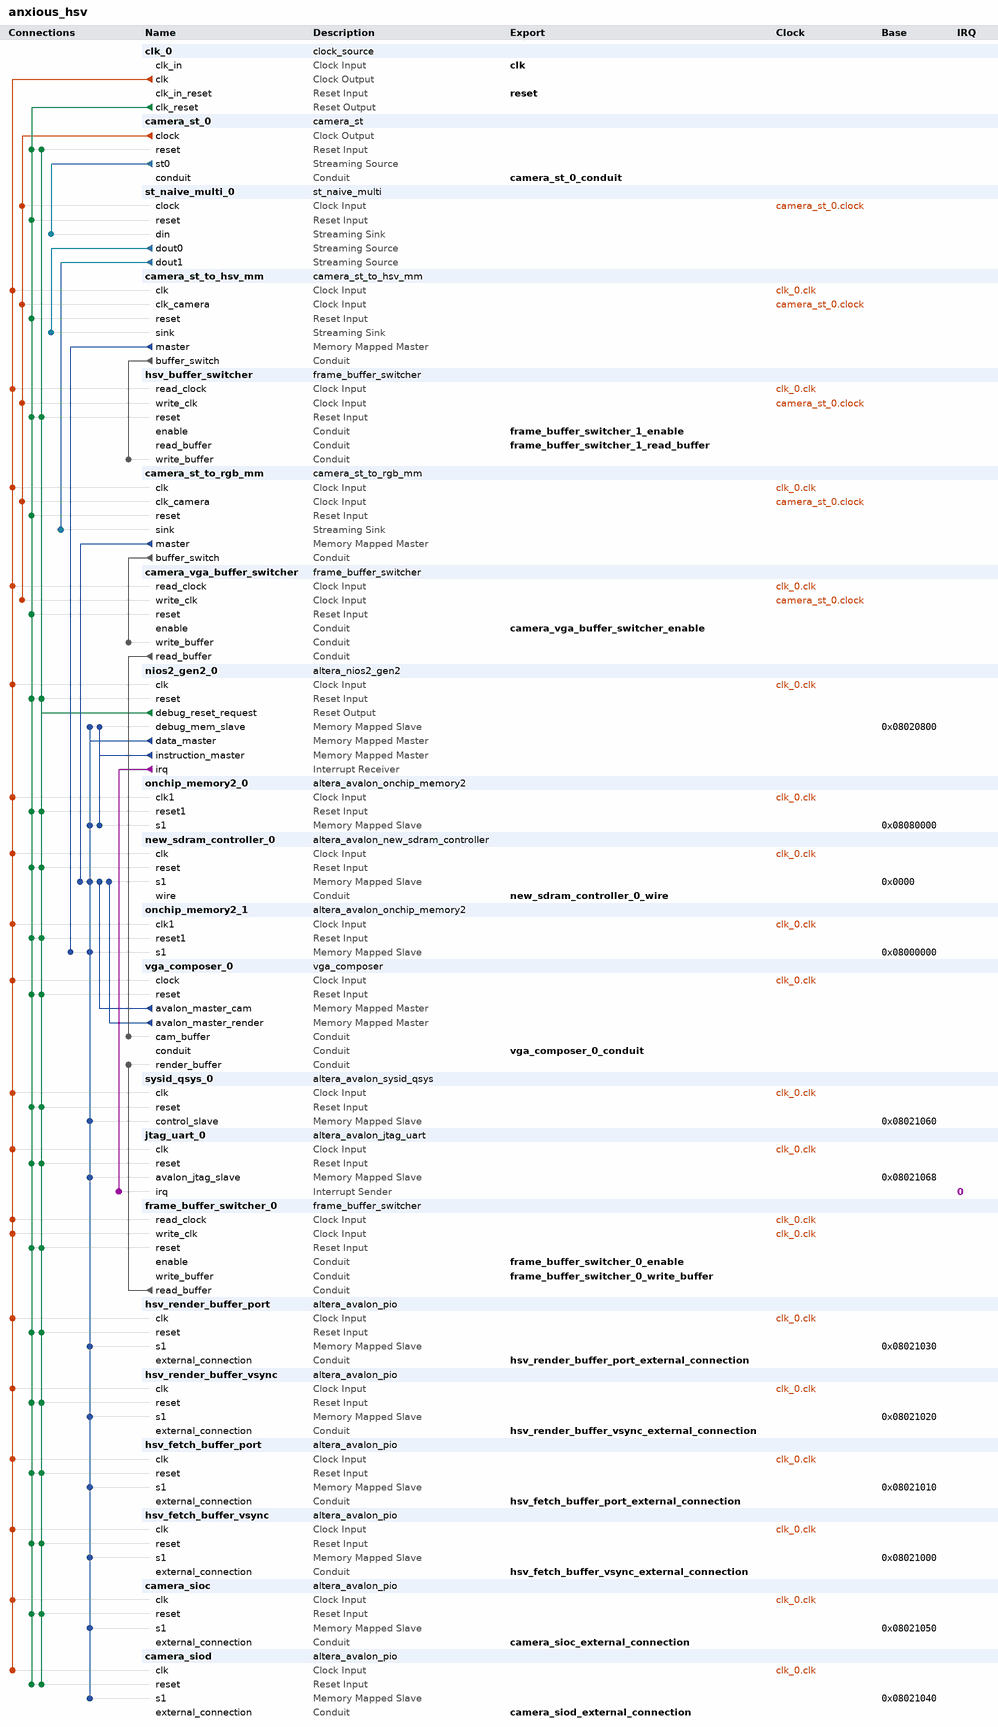
[diagram p0: system contents]
# Platform Designer (Qsys) system anxious_hsv, Cyclone IV GX EP4CGX150DF31C7
# Parameters at their usual value, and those the tool derives, are not listed.
package require -exact qsys 15.0
create_system anxious_hsv
set_project_property DEVICE_FAMILY {Cyclone IV GX}
set_project_property DEVICE EP4CGX150DF31C7

add_instance clk_0 clock_source 15.0
set_instance_parameter_value clk_0 clockFrequency 50000000

add_instance camera_st_0 camera_st 1.0
set_instance_parameter_value camera_st_0 DATA_WIDTH 24

add_instance st_naive_multi_0 st_naive_multi 1.0
set_instance_parameter_value st_naive_multi_0 DIN_DATA_WIDTH 24
set_instance_parameter_value st_naive_multi_0 DOUT0_DATA_WIDTH 24
set_instance_parameter_value st_naive_multi_0 DOUT1_DATA_WIDTH 32

add_instance camera_st_to_hsv_mm camera_st_to_hsv_mm 1.0

add_instance hsv_buffer_switcher frame_buffer_switcher 2.0

add_instance camera_st_to_rgb_mm camera_st_to_rgb_mm 1.0

add_instance camera_vga_buffer_switcher frame_buffer_switcher 2.0

add_instance nios2_gen2_0 altera_nios2_gen2 15.0
set_instance_parameter_value nios2_gen2_0 dcache_size 2048
set_instance_parameter_value nios2_gen2_0 exceptionSlave onchip_memory2_0.s1
set_instance_parameter_value nios2_gen2_0 icache_size 4096
set_instance_parameter_value nios2_gen2_0 impl Fast
set_instance_parameter_value nios2_gen2_0 resetSlave onchip_memory2_0.s1

add_instance onchip_memory2_0 altera_avalon_onchip_memory2 15.0
set_instance_parameter_value onchip_memory2_0 dataWidth 32
set_instance_parameter_value onchip_memory2_0 dualPort false
set_instance_parameter_value onchip_memory2_0 initMemContent true
set_instance_parameter_value onchip_memory2_0 initializationFileName onchip_mem.hex
set_instance_parameter_value onchip_memory2_0 memorySize 204800

add_instance new_sdram_controller_0 altera_avalon_new_sdram_controller 15.0
set_instance_parameter_value new_sdram_controller_0 TAC 5.5
set_instance_parameter_value new_sdram_controller_0 TRCD 20.0
set_instance_parameter_value new_sdram_controller_0 TRP 20.0
set_instance_parameter_value new_sdram_controller_0 casLatency 3
set_instance_parameter_value new_sdram_controller_0 columnWidth 10
set_instance_parameter_value new_sdram_controller_0 dataWidth 32
set_instance_parameter_value new_sdram_controller_0 generateSimulationModel false
set_instance_parameter_value new_sdram_controller_0 initRefreshCommands 8
set_instance_parameter_value new_sdram_controller_0 model single_Micron_MT48LC4M32B2_7_chip
set_instance_parameter_value new_sdram_controller_0 numberOfBanks 4
set_instance_parameter_value new_sdram_controller_0 numberOfChipSelects 1
set_instance_parameter_value new_sdram_controller_0 powerUpDelay 100.0
set_instance_parameter_value new_sdram_controller_0 refreshPeriod 7.8125
set_instance_parameter_value new_sdram_controller_0 rowWidth 13

add_instance onchip_memory2_1 altera_avalon_onchip_memory2 15.0
set_instance_parameter_value onchip_memory2_1 dataWidth 32
set_instance_parameter_value onchip_memory2_1 dualPort false
set_instance_parameter_value onchip_memory2_1 initMemContent true
set_instance_parameter_value onchip_memory2_1 initializationFileName onchip_mem.hex
set_instance_parameter_value onchip_memory2_1 memorySize 131072

add_instance vga_composer_0 vga_composer 1.1
set_instance_parameter_value vga_composer_0 ADDR_WIDTH 27
set_instance_parameter_value vga_composer_0 CAM_BANK 0
set_instance_parameter_value vga_composer_0 DATA_WIDTH 32
set_instance_parameter_value vga_composer_0 FIFO_LENGTH_LOG_2 6
set_instance_parameter_value vga_composer_0 RENDER_BANK 1

add_instance sysid_qsys_0 altera_avalon_sysid_qsys 15.0
set_instance_parameter_value sysid_qsys_0 id 2004318071

add_instance jtag_uart_0 altera_avalon_jtag_uart 15.0
set_instance_parameter_value jtag_uart_0 simInteractiveOptions NO_INTERACTIVE_WINDOWS

add_instance frame_buffer_switcher_0 frame_buffer_switcher 2.0

add_instance hsv_render_buffer_port altera_avalon_pio 15.0
set_instance_parameter_value hsv_render_buffer_port direction Input
set_instance_parameter_value hsv_render_buffer_port width 2

add_instance hsv_render_buffer_vsync altera_avalon_pio 15.0
set_instance_parameter_value hsv_render_buffer_vsync direction Output
set_instance_parameter_value hsv_render_buffer_vsync width 1

add_instance hsv_fetch_buffer_port altera_avalon_pio 15.0
set_instance_parameter_value hsv_fetch_buffer_port direction Input
set_instance_parameter_value hsv_fetch_buffer_port width 2

add_instance hsv_fetch_buffer_vsync altera_avalon_pio 15.0
set_instance_parameter_value hsv_fetch_buffer_vsync direction Output
set_instance_parameter_value hsv_fetch_buffer_vsync width 1

add_instance camera_sioc altera_avalon_pio 15.0
set_instance_parameter_value camera_sioc direction Output
set_instance_parameter_value camera_sioc width 1

add_instance camera_siod altera_avalon_pio 15.0
set_instance_parameter_value camera_siod direction Bidir
set_instance_parameter_value camera_siod width 1

# connections
add_connection camera_st_0.clock camera_st_to_hsv_mm.clk_camera clock
add_connection camera_st_0.clock camera_st_to_rgb_mm.clk_camera clock
add_connection camera_st_0.clock camera_vga_buffer_switcher.write_clk clock
add_connection camera_st_0.clock hsv_buffer_switcher.write_clk clock
add_connection camera_st_0.clock st_naive_multi_0.clock clock
add_connection clk_0.clk camera_sioc.clk clock
add_connection clk_0.clk camera_siod.clk clock
add_connection clk_0.clk camera_st_to_hsv_mm.clk clock
add_connection clk_0.clk camera_st_to_rgb_mm.clk clock
add_connection clk_0.clk camera_vga_buffer_switcher.read_clock clock
add_connection clk_0.clk frame_buffer_switcher_0.read_clock clock
add_connection clk_0.clk frame_buffer_switcher_0.write_clk clock
add_connection clk_0.clk hsv_buffer_switcher.read_clock clock
add_connection clk_0.clk hsv_fetch_buffer_port.clk clock
add_connection clk_0.clk hsv_fetch_buffer_vsync.clk clock
add_connection clk_0.clk hsv_render_buffer_port.clk clock
add_connection clk_0.clk hsv_render_buffer_vsync.clk clock
add_connection clk_0.clk jtag_uart_0.clk clock
add_connection clk_0.clk new_sdram_controller_0.clk clock
add_connection clk_0.clk nios2_gen2_0.clk clock
add_connection clk_0.clk onchip_memory2_0.clk1 clock
add_connection clk_0.clk onchip_memory2_1.clk1 clock
add_connection clk_0.clk sysid_qsys_0.clk clock
add_connection clk_0.clk vga_composer_0.clock clock
add_connection clk_0.clk_reset camera_sioc.reset reset
add_connection clk_0.clk_reset camera_siod.reset reset
add_connection clk_0.clk_reset camera_st_0.reset reset
add_connection clk_0.clk_reset camera_st_to_hsv_mm.reset reset
add_connection clk_0.clk_reset camera_st_to_rgb_mm.reset reset
add_connection clk_0.clk_reset camera_vga_buffer_switcher.reset reset
add_connection clk_0.clk_reset frame_buffer_switcher_0.reset reset
add_connection clk_0.clk_reset hsv_buffer_switcher.reset reset
add_connection clk_0.clk_reset hsv_fetch_buffer_port.reset reset
add_connection clk_0.clk_reset hsv_fetch_buffer_vsync.reset reset
add_connection clk_0.clk_reset hsv_render_buffer_port.reset reset
add_connection clk_0.clk_reset hsv_render_buffer_vsync.reset reset
add_connection clk_0.clk_reset jtag_uart_0.reset reset
add_connection clk_0.clk_reset new_sdram_controller_0.reset reset
add_connection clk_0.clk_reset nios2_gen2_0.reset reset
add_connection clk_0.clk_reset onchip_memory2_0.reset1 reset
add_connection clk_0.clk_reset onchip_memory2_1.reset1 reset
add_connection clk_0.clk_reset st_naive_multi_0.reset reset
add_connection clk_0.clk_reset sysid_qsys_0.reset reset
add_connection clk_0.clk_reset vga_composer_0.reset reset
add_connection nios2_gen2_0.debug_reset_request camera_sioc.reset reset
add_connection nios2_gen2_0.debug_reset_request camera_siod.reset reset
add_connection nios2_gen2_0.debug_reset_request camera_st_0.reset reset
add_connection nios2_gen2_0.debug_reset_request frame_buffer_switcher_0.reset reset
add_connection nios2_gen2_0.debug_reset_request hsv_buffer_switcher.reset reset
add_connection nios2_gen2_0.debug_reset_request hsv_fetch_buffer_port.reset reset
add_connection nios2_gen2_0.debug_reset_request hsv_fetch_buffer_vsync.reset reset
add_connection nios2_gen2_0.debug_reset_request hsv_render_buffer_port.reset reset
add_connection nios2_gen2_0.debug_reset_request hsv_render_buffer_vsync.reset reset
add_connection nios2_gen2_0.debug_reset_request jtag_uart_0.reset reset
add_connection nios2_gen2_0.debug_reset_request new_sdram_controller_0.reset reset
add_connection nios2_gen2_0.debug_reset_request nios2_gen2_0.reset reset
add_connection nios2_gen2_0.debug_reset_request onchip_memory2_0.reset1 reset
add_connection nios2_gen2_0.debug_reset_request onchip_memory2_1.reset1 reset
add_connection nios2_gen2_0.debug_reset_request sysid_qsys_0.reset reset
add_connection nios2_gen2_0.debug_reset_request vga_composer_0.reset reset
add_connection camera_st_to_hsv_mm.master onchip_memory2_1.s1 avalon
set_connection_parameter_value camera_st_to_hsv_mm.master/onchip_memory2_1.s1 baseAddress 0x08000000
add_connection camera_st_to_rgb_mm.master new_sdram_controller_0.s1 avalon
set_connection_parameter_value camera_st_to_rgb_mm.master/new_sdram_controller_0.s1 baseAddress 0x0000
add_connection nios2_gen2_0.data_master camera_sioc.s1 avalon
set_connection_parameter_value nios2_gen2_0.data_master/camera_sioc.s1 baseAddress 0x08021050
add_connection nios2_gen2_0.data_master camera_siod.s1 avalon
set_connection_parameter_value nios2_gen2_0.data_master/camera_siod.s1 baseAddress 0x08021040
add_connection nios2_gen2_0.data_master hsv_fetch_buffer_port.s1 avalon
set_connection_parameter_value nios2_gen2_0.data_master/hsv_fetch_buffer_port.s1 baseAddress 0x08021010
add_connection nios2_gen2_0.data_master hsv_fetch_buffer_vsync.s1 avalon
set_connection_parameter_value nios2_gen2_0.data_master/hsv_fetch_buffer_vsync.s1 baseAddress 0x08021000
add_connection nios2_gen2_0.data_master hsv_render_buffer_port.s1 avalon
set_connection_parameter_value nios2_gen2_0.data_master/hsv_render_buffer_port.s1 baseAddress 0x08021030
add_connection nios2_gen2_0.data_master hsv_render_buffer_vsync.s1 avalon
set_connection_parameter_value nios2_gen2_0.data_master/hsv_render_buffer_vsync.s1 baseAddress 0x08021020
add_connection nios2_gen2_0.data_master jtag_uart_0.avalon_jtag_slave avalon
set_connection_parameter_value nios2_gen2_0.data_master/jtag_uart_0.avalon_jtag_slave baseAddress 0x08021068
add_connection nios2_gen2_0.data_master new_sdram_controller_0.s1 avalon
set_connection_parameter_value nios2_gen2_0.data_master/new_sdram_controller_0.s1 baseAddress 0x0000
add_connection nios2_gen2_0.data_master nios2_gen2_0.debug_mem_slave avalon
set_connection_parameter_value nios2_gen2_0.data_master/nios2_gen2_0.debug_mem_slave baseAddress 0x08020800
add_connection nios2_gen2_0.data_master onchip_memory2_0.s1 avalon
set_connection_parameter_value nios2_gen2_0.data_master/onchip_memory2_0.s1 baseAddress 0x08080000
add_connection nios2_gen2_0.data_master onchip_memory2_1.s1 avalon
set_connection_parameter_value nios2_gen2_0.data_master/onchip_memory2_1.s1 baseAddress 0x08000000
add_connection nios2_gen2_0.data_master sysid_qsys_0.control_slave avalon
set_connection_parameter_value nios2_gen2_0.data_master/sysid_qsys_0.control_slave baseAddress 0x08021060
add_connection nios2_gen2_0.instruction_master nios2_gen2_0.debug_mem_slave avalon
set_connection_parameter_value nios2_gen2_0.instruction_master/nios2_gen2_0.debug_mem_slave baseAddress 0x08020800
add_connection nios2_gen2_0.instruction_master onchip_memory2_0.s1 avalon
set_connection_parameter_value nios2_gen2_0.instruction_master/onchip_memory2_0.s1 baseAddress 0x08080000
add_connection vga_composer_0.avalon_master_cam new_sdram_controller_0.s1 avalon
set_connection_parameter_value vga_composer_0.avalon_master_cam/new_sdram_controller_0.s1 baseAddress 0x0000
add_connection vga_composer_0.avalon_master_render new_sdram_controller_0.s1 avalon
set_connection_parameter_value vga_composer_0.avalon_master_render/new_sdram_controller_0.s1 baseAddress 0x0000
add_connection camera_st_0.st0 st_naive_multi_0.din avalon_streaming
add_connection st_naive_multi_0.dout0 camera_st_to_hsv_mm.sink avalon_streaming
add_connection st_naive_multi_0.dout1 camera_st_to_rgb_mm.sink avalon_streaming
add_connection camera_st_to_hsv_mm.buffer_switch hsv_buffer_switcher.write_buffer conduit
add_connection camera_st_to_rgb_mm.buffer_switch camera_vga_buffer_switcher.write_buffer conduit
add_connection camera_vga_buffer_switcher.read_buffer vga_composer_0.cam_buffer conduit
add_connection frame_buffer_switcher_0.read_buffer vga_composer_0.render_buffer conduit
add_connection nios2_gen2_0.irq jtag_uart_0.irq interrupt
set_connection_parameter_value nios2_gen2_0.irq/jtag_uart_0.irq irqNumber 0

# exported interfaces
add_interface camera_sioc_external_connection conduit end
set_interface_property camera_sioc_external_connection EXPORT_OF camera_sioc.external_connection
add_interface camera_siod_external_connection conduit end
set_interface_property camera_siod_external_connection EXPORT_OF camera_siod.external_connection
add_interface camera_st_0_conduit conduit end
set_interface_property camera_st_0_conduit EXPORT_OF camera_st_0.conduit
add_interface camera_vga_buffer_switcher_enable conduit end
set_interface_property camera_vga_buffer_switcher_enable EXPORT_OF camera_vga_buffer_switcher.enable
add_interface clk clock sink
set_interface_property clk EXPORT_OF clk_0.clk_in
add_interface frame_buffer_switcher_0_enable conduit end
set_interface_property frame_buffer_switcher_0_enable EXPORT_OF frame_buffer_switcher_0.enable
add_interface frame_buffer_switcher_0_write_buffer conduit end
set_interface_property frame_buffer_switcher_0_write_buffer EXPORT_OF frame_buffer_switcher_0.write_buffer
add_interface frame_buffer_switcher_1_enable conduit end
set_interface_property frame_buffer_switcher_1_enable EXPORT_OF hsv_buffer_switcher.enable
add_interface frame_buffer_switcher_1_read_buffer conduit end
set_interface_property frame_buffer_switcher_1_read_buffer EXPORT_OF hsv_buffer_switcher.read_buffer
add_interface hsv_fetch_buffer_port_external_connection conduit end
set_interface_property hsv_fetch_buffer_port_external_connection EXPORT_OF hsv_fetch_buffer_port.external_connection
add_interface hsv_fetch_buffer_vsync_external_connection conduit end
set_interface_property hsv_fetch_buffer_vsync_external_connection EXPORT_OF hsv_fetch_buffer_vsync.external_connection
add_interface hsv_render_buffer_port_external_connection conduit end
set_interface_property hsv_render_buffer_port_external_connection EXPORT_OF hsv_render_buffer_port.external_connection
add_interface hsv_render_buffer_vsync_external_connection conduit end
set_interface_property hsv_render_buffer_vsync_external_connection EXPORT_OF hsv_render_buffer_vsync.external_connection
add_interface new_sdram_controller_0_wire conduit end
set_interface_property new_sdram_controller_0_wire EXPORT_OF new_sdram_controller_0.wire
add_interface reset reset sink
set_interface_property reset EXPORT_OF clk_0.clk_in_reset
add_interface vga_composer_0_conduit conduit end
set_interface_property vga_composer_0_conduit EXPORT_OF vga_composer_0.conduit

set_interconnect_requirement {$system} qsys_mm.clockCrossingAdapter HANDSHAKE
set_interconnect_requirement {$system} qsys_mm.enableEccProtection FALSE
set_interconnect_requirement {$system} qsys_mm.insertDefaultSlave FALSE
set_interconnect_requirement {$system} qsys_mm.maxAdditionalLatency 1

save_system anxious_hsv.qsys
